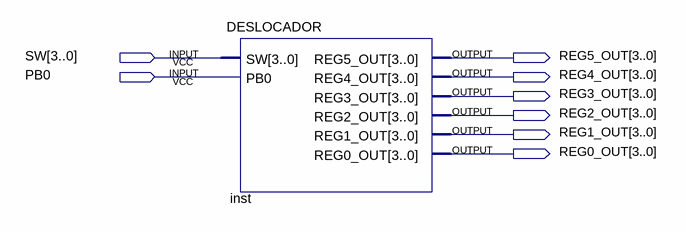
[diagram p0: schematic sheet]
// Quartus schematic teste.bdf as structural Verilog: 1 symbols, 8 pins
module teste (
  input  [3:0] SW,
  input  PB0,
  output [3:0] REG5_OUT,
  output [3:0] REG4_OUT,
  output [3:0] REG3_OUT,
  output [3:0] REG2_OUT,
  output [3:0] REG1_OUT,
  output [3:0] REG0_OUT
);

  DESLOCADOR inst (
    .SW(SW), .PB0(PB0), .REG5_OUT(REG5_OUT), .REG4_OUT(REG4_OUT), .REG3_OUT(REG3_OUT), .REG2_OUT(REG2_OUT),
    .REG1_OUT(REG1_OUT), .REG0_OUT(REG0_OUT));
endmodule
